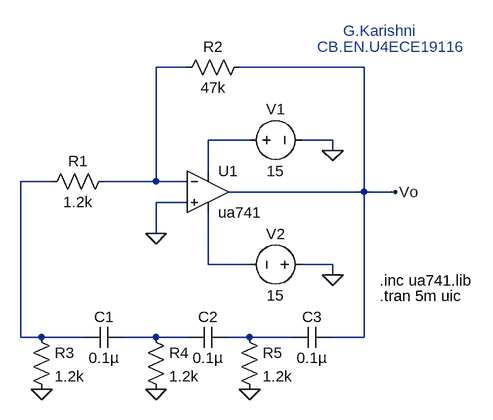
[diagram p0: schematic Draft2_RC oscillator.asc]
Draft2_RC oscillator.asc, the LTspice schematic file:
Version 4
SHEET 1 880 680
WIRE 160 -32 112 -32
WIRE 432 -32 240 -32
WIRE 256 80 192 80
WIRE 384 80 336 80
WIRE 384 96 384 80
WIRE 192 128 192 80
WIRE -48 144 -96 144
WIRE 112 144 112 -32
WIRE 112 144 32 144
WIRE 160 144 112 144
WIRE 432 160 432 -32
WIRE 432 160 224 160
WIRE 480 160 432 160
WIRE 160 176 112 176
WIRE 112 224 112 176
WIRE 192 272 192 192
WIRE 256 272 192 272
WIRE 384 272 336 272
WIRE 384 288 384 272
WIRE -96 384 -96 144
WIRE -64 384 -96 384
WIRE 0 384 -64 384
WIRE 112 384 64 384
WIRE 160 384 112 384
WIRE 256 384 224 384
WIRE 320 384 256 384
WIRE 432 384 432 160
WIRE 432 384 384 384
FLAG 384 96 0
FLAG 384 288 0
FLAG -64 464 0
FLAG 112 464 0
FLAG 256 464 0
FLAG 480 160 Vo
FLAG 112 224 0
SYMBOL OpAmps\\ua741 192 96 R0
SYMATTR InstName U1
SYMBOL voltage 240 80 R270
WINDOW 0 32 56 VTop 2
WINDOW 3 -32 56 VBottom 2
WINDOW 123 0 0 Left 0
WINDOW 39 0 0 Left 0
SYMATTR InstName V1
SYMATTR Value 15
SYMBOL voltage 352 272 R90
WINDOW 0 -32 56 VBottom 2
WINDOW 3 32 56 VTop 2
WINDOW 123 0 0 Left 0
WINDOW 39 0 0 Left 0
SYMATTR InstName V2
SYMATTR Value 15
SYMBOL res 48 128 R90
WINDOW 0 0 56 VBottom 2
WINDOW 3 32 56 VTop 2
SYMATTR InstName R1
SYMATTR Value 1.2k
SYMBOL res 256 -48 R90
WINDOW 0 0 56 VBottom 2
WINDOW 3 32 56 VTop 2
SYMATTR InstName R2
SYMATTR Value 47k
SYMBOL res -80 368 R0
SYMATTR InstName R3
SYMATTR Value 1.2k
SYMBOL res 96 368 R0
SYMATTR InstName R4
SYMATTR Value 1.2k
SYMBOL res 240 368 R0
SYMATTR InstName R5
SYMATTR Value 1.2k
SYMBOL cap 64 368 R90
WINDOW 0 0 32 VBottom 2
WINDOW 3 32 32 VTop 2
SYMATTR InstName C1
SYMATTR Value 0.1µ
SYMBOL cap 224 368 R90
WINDOW 0 0 32 VBottom 2
WINDOW 3 32 32 VTop 2
SYMATTR InstName C2
SYMATTR Value 0.1µ
SYMBOL cap 384 368 R90
WINDOW 0 0 32 VBottom 2
WINDOW 3 32 32 VTop 2
SYMATTR InstName C3
SYMATTR Value 0.1µ
TEXT 456 296 Left 2 !.inc ua741.lib
TEXT 456 320 Left 2 !.tran 5m uic
TEXT 400 -88 Left 2 ;G.Karishni
TEXT 360 -64 Left 2 ;CB.EN.U4ECE19116

The netlist it stands for:
* Draft2_RC oscillator.asc
XU1 0 N001 N002 N004 Vo ua741  ; pins In+ In- V+ V- OUT
V1 N002 0 15
V2 0 N004 15
R1 N001 N003 1.2k
R2 Vo N001 47k
R3 N003 0 1.2k
R4 N005 0 1.2k
R5 N006 0 1.2k
C1 N005 N003 0.1µ
C2 N006 N005 0.1µ
C3 Vo N006 0.1µ
.inc ua741.lib
.tran 5m uic
* G.Karishni
* CB.EN.U4ECE19116
.backanno
.end